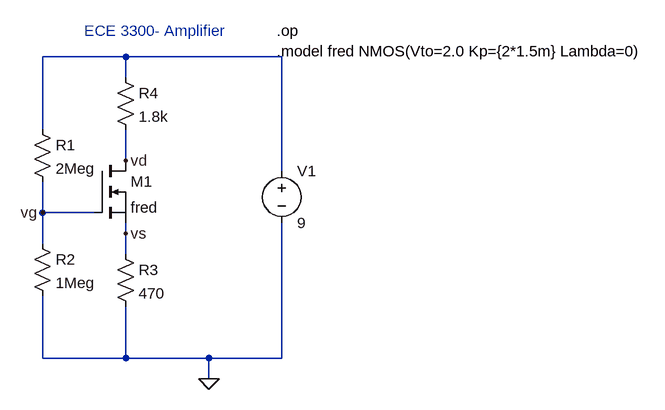
[diagram p0: schematic ECE3300_Amplifier.asc]
ECE3300_Amplifier.asc, the LTspice schematic file:
Version 4
SHEET 1 1072 680
WIRE 208 -48 80 -48
WIRE 448 -48 208 -48
WIRE 208 -16 208 -48
WIRE 80 64 80 -48
WIRE 208 112 208 64
WIRE 448 128 448 -48
WIRE 80 192 80 144
WIRE 160 192 80 192
WIRE 208 224 208 208
WIRE 80 240 80 192
WIRE 208 256 208 224
WIRE 80 416 80 320
WIRE 208 416 208 336
WIRE 208 416 80 416
WIRE 336 416 208 416
WIRE 448 416 448 208
WIRE 448 416 336 416
WIRE 336 448 336 416
FLAG 336 448 0
FLAG 208 112 vd
FLAG 80 192 vg
FLAG 208 224 vs
SYMBOL res 64 48 R0
SYMATTR InstName R1
SYMATTR Value 2Meg
SYMBOL res 64 224 R0
SYMATTR InstName R2
SYMATTR Value 1Meg
SYMBOL res 192 240 R0
SYMATTR InstName R3
SYMATTR Value 470
SYMBOL res 192 -32 R0
SYMATTR InstName R4
SYMATTR Value 1.8k
SYMBOL nmos 160 112 R0
SYMATTR InstName M1
SYMATTR Value fred
SYMBOL voltage 448 112 R0
WINDOW 123 0 0 Left 0
WINDOW 39 0 0 Left 0
SYMATTR InstName V1
SYMATTR Value 9
TEXT 144 -88 Left 2 ;ECE 3300- Amplifier
TEXT 440 -88 Left 2 !.op\n.model fred NMOS(Vto=2.0 Kp={2*1.5m} Lambda=0)

The netlist it stands for:
* ECE3300_Amplifier.asc
R1 N001 vg 2Meg
R2 vg 0 1Meg
R3 vs 0 470
R4 N001 vd 1.8k
M1 vd vg vs vs fred
V1 N001 0 9
.model NMOS NMOS
.model PMOS PMOS
.lib standard.mos
* ECE 3300- Amplifier
.op
.model fred NMOS(Vto=2.0 Kp={2*1.5m} Lambda=0)
.backanno
.end